# EasyEDA Pro project 2025NUEDC_A_Project.eprj, schematic Schematic1
Board Name: 电压电流采样; Create Date: 2025-08-12; Page Name: P1; Project Name: 2025NUEDC_A_Project; Schematic Name: Schematic1; Update Date: 2025-08-12; Company: 嘉立创EDA; Page Size: A4; Version: V1.0
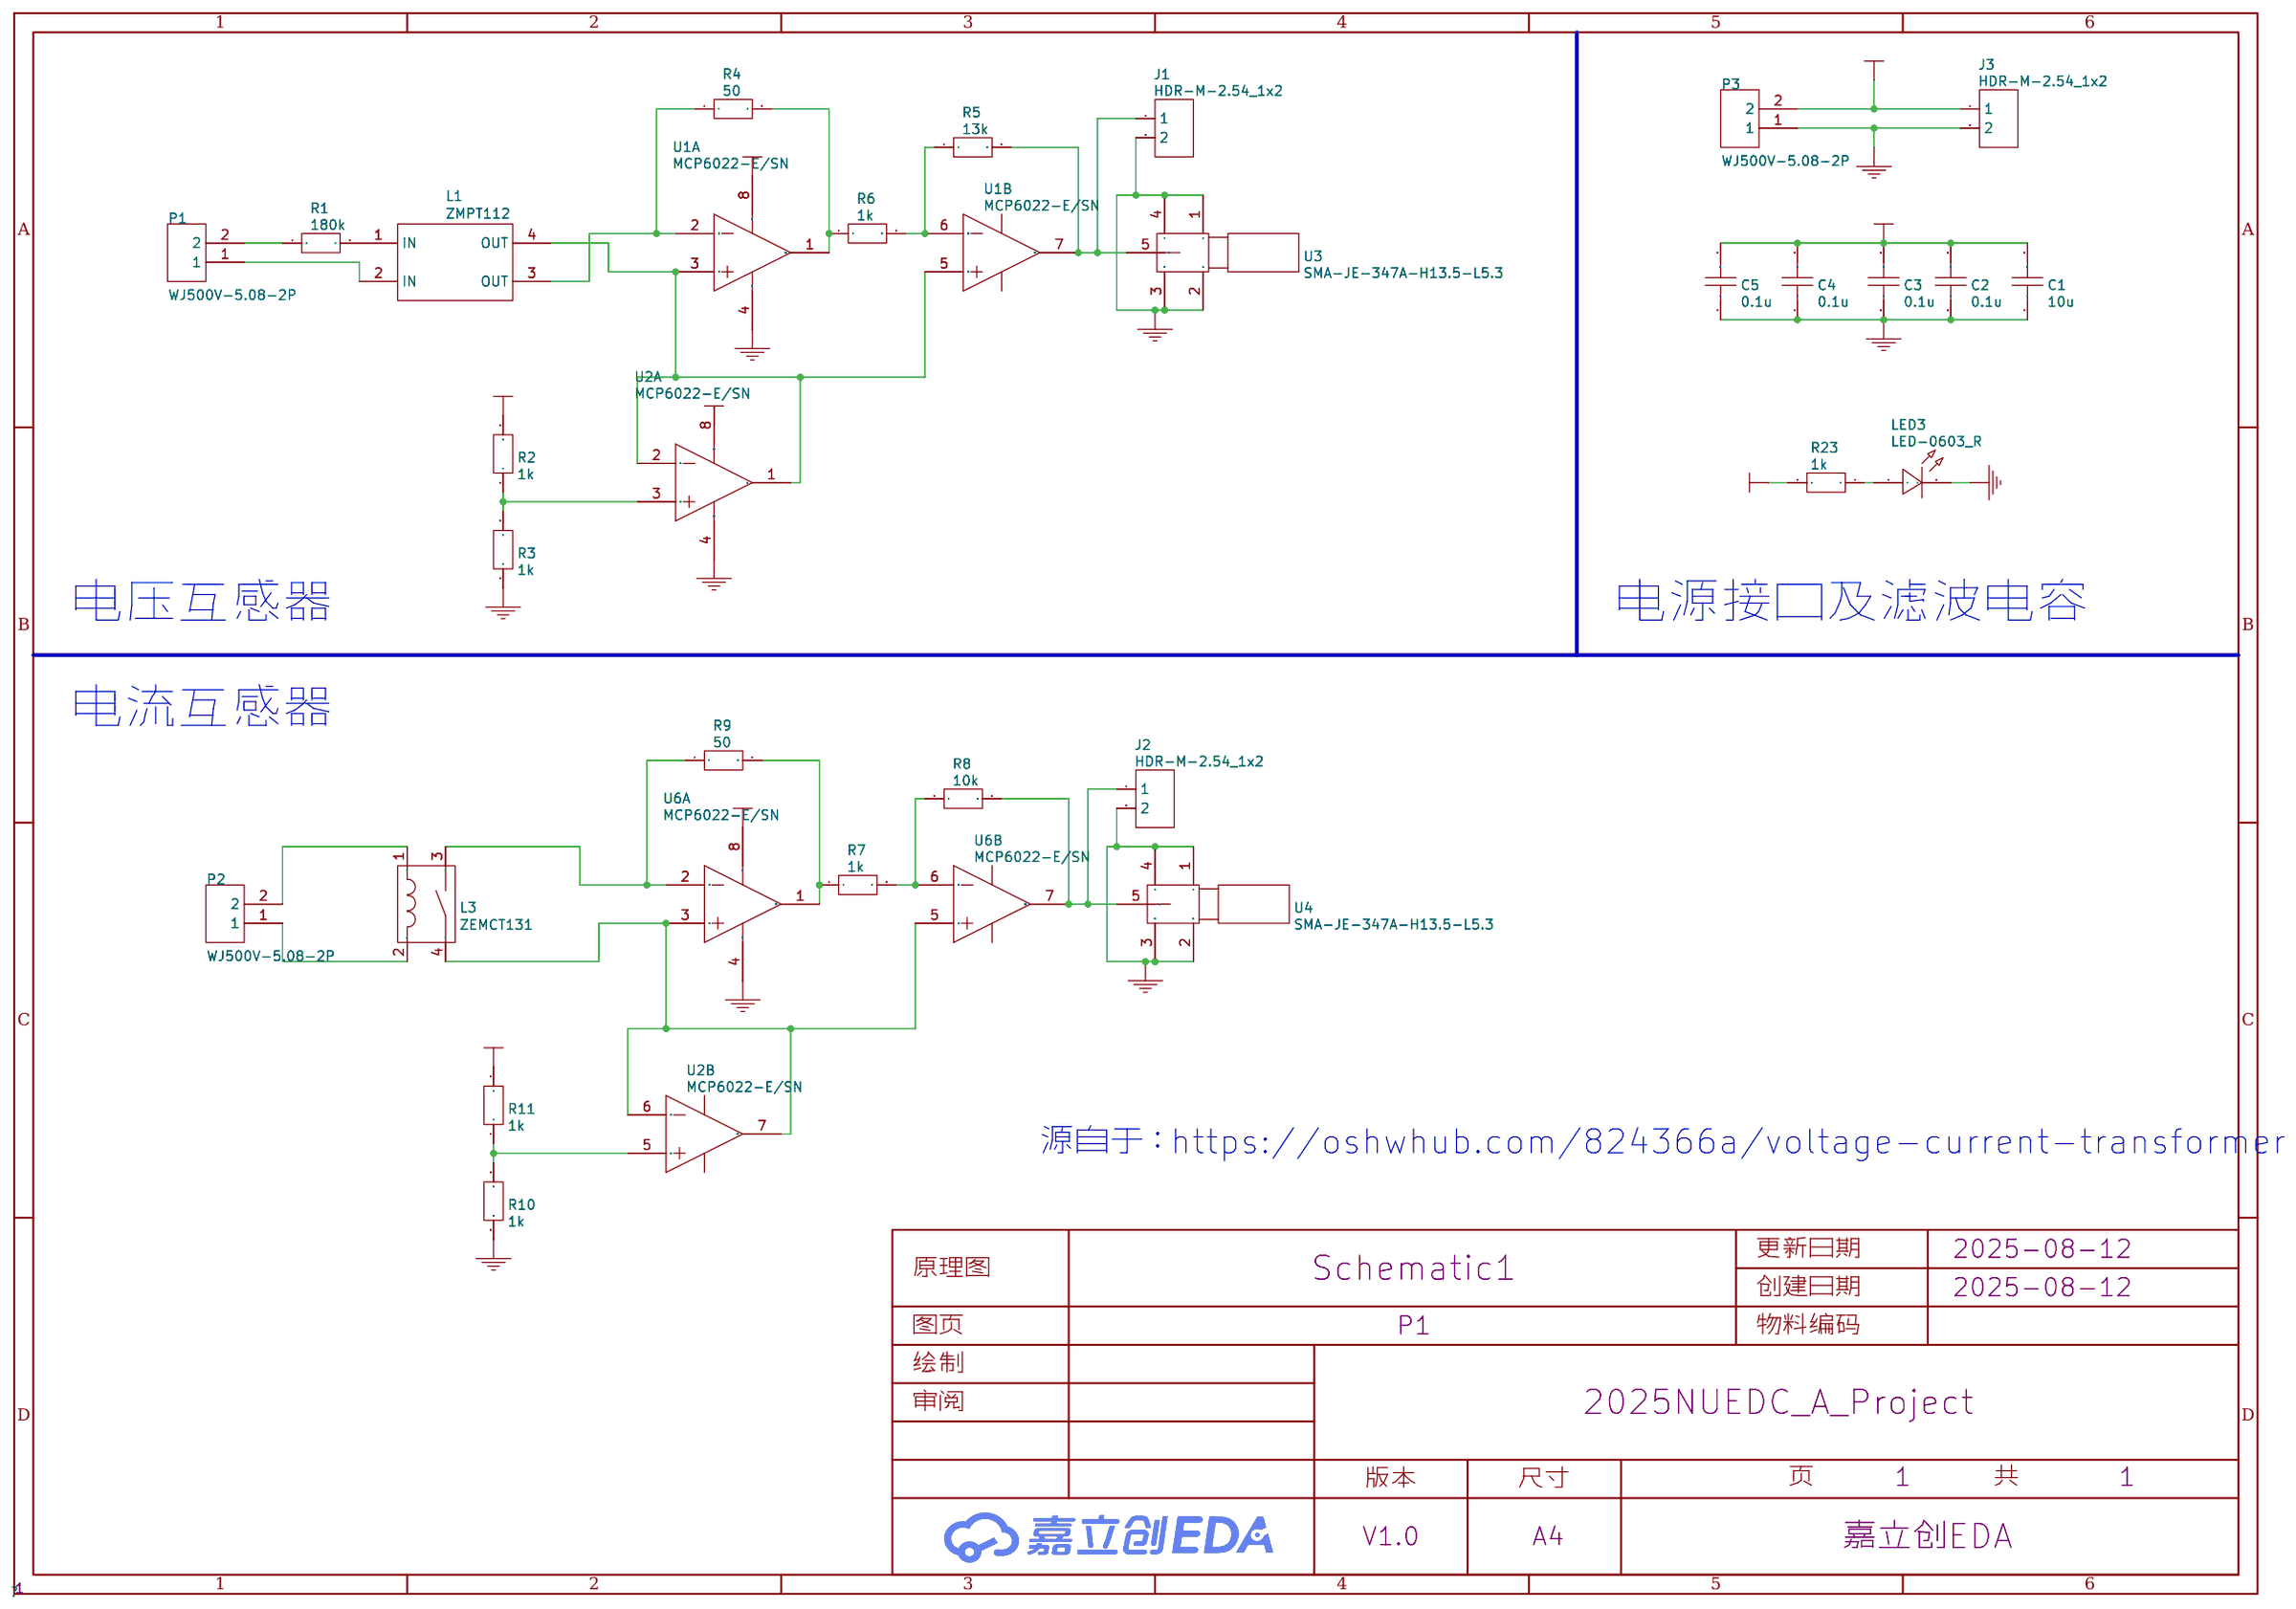
[diagram p2: schematic sheet]

## Parts
C1  10u  [C0805]
C2  0.1u  [C0603]
C3  0.1u  [C0603]
C4  0.1u  [C0603]
C5  0.1u  [C0603]
J1  HDR-M-2.54_1x2  [HDR-M-2.54_1X2]
J2  HDR-M-2.54_1x2  [HDR-M-2.54_1X2]
J3  HDR-M-2.54_1x2  [HDR-M-2.54_1X2]
L1  ZMPT112  [XFMR-TH_ZMPT112]
L3  ZEMCT131  [IND-TH_ZEMCT131]
LED3  LED-0603_R  [LED0603_RED]
P1  WJ500V-5.08-2P  [CONN-TH_2P-P5.00_WJ500V-5.08-2P]
P2  WJ500V-5.08-2P  [CONN-TH_2P-P5.00_WJ500V-5.08-2P]
P3  WJ500V-5.08-2P  [CONN-TH_2P-P5.00_WJ500V-5.08-2P]
R1  180k  [R0603]
R2  1k  [R0603]
R3  1k  [R0603]
R4  50  [R0603]
R5  13k  [R0603]
R6  1k  [R0603]
R7  1k  [R0603]
R8  10k  [R0603]
R9  50  [R0603]
R10  1k  [R0603]
R11  1k  [R0603]
R23  1k  [R0603]
U1  MCP6022-E/SN  [SOIC-8_L4.9-W3.9-P1.27-LS6.0-BL]  (sections 1,2)
U2  MCP6022-E/SN  [SOIC-8_L4.9-W3.9-P1.27-LS6.0-BL]  (sections 1,2)
U3  SMA-JE-347A-H13.5-L5.3  [SMA-TH_HC-SMA6565-13H-G]
U4  SMA-JE-347A-H13.5-L5.3  [SMA-TH_HC-SMA6565-13H-G]
U6  MCP6022-E/SN  [SOIC-8_L4.9-W3.9-P1.27-LS6.0-BL]  (sections 1,2)

## Library data of the parts
C1 = 10u
C2-C5 = 0.1u
J1-J3 = HDR-M-2.54_1x2: Supplier Part: C124375; Supplier: LCSC
L1 = ZMPT112: Supplier: LCSC; Manufacturer: 择明朗熙; Supplier Part: C84214; JLCPCB Part Class: Extended Part
L3 = ZEMCT131: Supplier: LCSC; Supplier Part: C117927; Manufacturer: 择明朗熙; JLCPCB Part Class: Extended Part
LED3 = 19-217/R6C-AL1M2VY/3T: Manufacturer: EVERLIGHT(台湾亿光); Supplier Part: C72044; Supplier: LCSC
P1-P3 = WJ500V-5.08-2P: 结构:1x2P;间距:5.08mm;颜色:绿色;安装方式:直插;额定电流:18A;额定电压:250V;排数:1;线规 - AWG:14~30;线规 - 平方毫米:2.5;每排PIN数:2;触头材质:-;触头镀层:-;工作温度范围:-40℃~+105℃;焊接温度(最大值):-;; LCSC Part Name: 1x2P 5.08mm 直插 排数:1 每排P数:2; Supplier Part: C8465; Manufacturer: KANGNEX(康奈克斯电气); Supplier Footprint: 插件,P=5.08mm; JLCPCB Part Class: 扩展库; Datasheet: https://atta.szlcsc.com/upload/public/pdf/source/20191225/C8465_02D34CE5B5B4A53DF5891601D97FA9F4.pdf; Supplier: LCSC; Structure: 1x2P; Pitch: 5.08mm; Color: 绿色; Mounting Style: 直插; Current Rating (Max): 18A; Voltage Rating (Max): 250V; Number of Pins: 2P; Number of Rows: 1; Wire Gauge - AWG: 14~30; Wire Gauge - mm2: 2.5; Number of PINs Per Row: 2; Operating Temperature Range: -40℃~+105℃; Screw Specification: M2.5
R1 = 180k
R2 R3 R6 R7 R10 R11 R23 = 1k
R4 R9 = 50
R5 = 13k
R8 = 10k
U1 U2 U6 = MCP6022-E/SN: Supplier: LCSC; Supplier Part: C511327; Manufacturer: MICROCHIP(美国微芯); JLCPCB Part Class: Extended Part
U3 U4 = SMA-JE-347A-H13.5-L5.3: Supplier: LCSC; Supplier Part: C5723183; Manufacturer: XUNPU(讯普); JLCPCB Part Class: Extended Part

## Nets
3V3: C1.2 C2.2 C3.2 C4.2 C5.2 J3.1 P3.2 R2.2 R11.2 R23.2 U1.8(VDD) U2.8(VDD) U6.8(VDD)
GND: C1.1 C2.1 C3.1 C4.1 C5.1 J1.2 J2.2 J3.2 LED3.2 P3.1 R3.1 R10.1 U1.4(VSS) U2.4(VSS) U3.1 U3.2 U3.3 U3.4 U4.1 U4.2 U4.3 U4.4 U6.4(VSS)
$1N1105: R2.1 R3.2 U2.3(VINA+)
$1N1106: L1.4(OUT) U1.3(VINA+) U1.5(VINB+) U2.1(VOUTA) U2.2(VINA-)
$1N1107: L1.3(OUT) R4.1 U1.2(VINA-)
$1N1108: R4.2 R6.1 U1.1(VOUTA)
$1N1109: R5.1 R6.2 U1.6(VINB-)
$1N1110: J1.1 R5.2 U1.7(VOUTB) U3.5
$1N1113: L3.3(NO) R9.1 U6.2(VINA-)
$1N1114: J2.1 R8.2 U4.5 U6.7(VOUTB)
$1N1115: R7.2 R8.1 U6.6(VINB-)
$1N1116: L3.4(COM) U2.6(VINB-) U2.7(VOUTB) U6.3(VINA+) U6.5(VINB+)
$1N1117: R7.1 R9.2 U6.1(VOUTA)
$1N1118: R10.2 R11.1 U2.5(VINB+)
$1N1123: LED3.1 R23.1
$1N1128: L1.1(IN) R1.2
$1N2942: L1.2(IN) P1.1
$1N2947: P1.2 R1.1
$1N2968: L3.1 P2.2
$1N2974: L3.2 P2.1

## Notes on the sheet
- 电压互感器
- 电源接口及滤波电容
- 电流互感器
- 源自于：https://oshwhub.com/824366a/voltage-current-transformer
